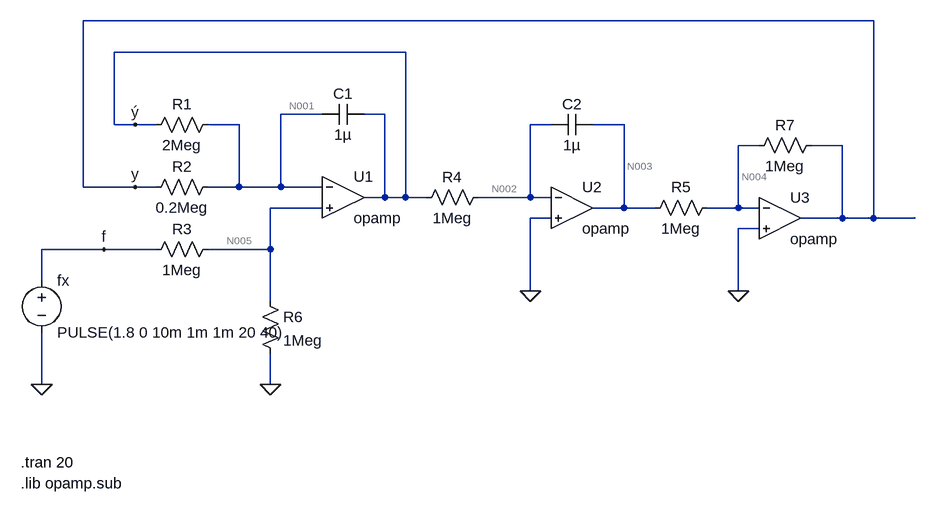
[diagram p0: schematic hw2.asc]
hw2.asc, the LTspice schematic file:
Version 4.1
SHEET 1 964 680
WIRE 896 -128 -320 -128
WIRE 176 -80 -272 -80
WIRE 48 16 -16 16
WIRE 144 16 112 16
WIRE -272 32 -272 -80
WIRE -240 32 -272 32
WIRE -208 32 -240 32
WIRE -80 32 -128 32
WIRE 400 32 368 32
WIRE 512 32 464 32
WIRE 720 64 688 64
WIRE 848 64 800 64
WIRE -320 128 -320 -128
WIRE -240 128 -320 128
WIRE -208 128 -240 128
WIRE -80 128 -80 32
WIRE -80 128 -128 128
WIRE -16 128 -16 16
WIRE -16 128 -80 128
WIRE 48 128 -16 128
WIRE 144 144 144 16
WIRE 144 144 112 144
WIRE 176 144 176 -80
WIRE 176 144 144 144
WIRE 208 144 176 144
WIRE 368 144 368 32
WIRE 368 144 288 144
WIRE 400 144 368 144
WIRE 48 160 -32 160
WIRE 512 160 512 32
WIRE 512 160 464 160
WIRE 560 160 512 160
WIRE 688 160 688 64
WIRE 688 160 640 160
WIRE 720 160 688 160
WIRE 400 176 368 176
WIRE 848 176 848 64
WIRE 848 176 784 176
WIRE 896 176 896 -128
WIRE 896 176 848 176
WIRE 960 176 896 176
WIRE 720 192 688 192
WIRE -288 224 -384 224
WIRE -208 224 -288 224
WIRE -32 224 -32 160
WIRE -32 224 -128 224
WIRE -384 272 -384 224
WIRE 368 288 368 176
WIRE 688 288 688 192
WIRE -32 304 -32 224
WIRE -384 432 -384 352
WIRE -32 432 -32 384
FLAG -32 432 0
FLAG 688 288 0
FLAG 368 288 0
FLAG -240 128 y
FLAG -240 32 ý
FLAG -288 224 f
FLAG -384 432 0
SYMBOL cap 112 0 R90
WINDOW 0 0 32 VBottom 2
WINDOW 3 32 32 VTop 2
SYMATTR InstName C1
SYMATTR Value 1µ
SYMBOL cap 464 16 R90
WINDOW 0 0 32 VBottom 2
WINDOW 3 32 32 VTop 2
SYMATTR InstName C2
SYMATTR Value 1µ
SYMBOL OpAmps\\opamp 80 80 R0
SYMATTR InstName U1
SYMBOL OpAmps\\opamp 432 96 R0
SYMATTR InstName U2
SYMBOL OpAmps\\opamp 752 112 R0
SYMATTR InstName U3
SYMBOL res -112 16 R90
WINDOW 0 0 56 VBottom 2
WINDOW 3 32 56 VTop 2
SYMATTR InstName R1
SYMATTR Value 2Meg
SYMBOL res -112 112 R90
WINDOW 0 0 56 VBottom 2
WINDOW 3 32 56 VTop 2
SYMATTR InstName R2
SYMATTR Value 0.2Meg
SYMBOL res -112 208 R90
WINDOW 0 0 56 VBottom 2
WINDOW 3 32 56 VTop 2
SYMATTR InstName R3
SYMATTR Value 1Meg
SYMBOL res 304 128 R90
WINDOW 0 0 56 VBottom 2
WINDOW 3 32 56 VTop 2
SYMATTR InstName R4
SYMATTR Value 1Meg
SYMBOL res 656 144 R90
WINDOW 0 0 56 VBottom 2
WINDOW 3 32 56 VTop 2
SYMATTR InstName R5
SYMATTR Value 1Meg
SYMBOL res -48 288 R0
SYMATTR InstName R6
SYMATTR Value 1Meg
SYMBOL res 816 48 R90
WINDOW 0 0 56 VBottom 2
WINDOW 3 32 56 VTop 2
SYMATTR InstName R7
SYMATTR Value 1Meg
SYMBOL voltage -384 256 R0
WINDOW 123 0 0 Left 0
WINDOW 39 0 0 Left 0
SYMATTR InstName fx
SYMATTR Value PULSE(1.8 0 10m 1m 1m 20 40)
TEXT -416 552 Left 2 !.tran 20
TEXT -416 584 Left 2 !.lib opamp.sub

The netlist it stands for:
* hw2.asc
C1 ý N001 1µ
C2 N003 N002 1µ
X§U1 N001 N005 ý opamp Aol=100K GBW=10Meg  ; pins invin noninvin out
X§U2 N002 0 N003 opamp Aol=100K GBW=10Meg  ; pins invin noninvin out
X§U3 N004 0 y opamp Aol=100K GBW=10Meg  ; pins invin noninvin out
R1 N001 ý 2Meg
R2 N001 y 0.2Meg
R3 N005 f 1Meg
R4 N002 ý 1Meg
R5 N004 N003 1Meg
R6 N005 0 1Meg
R7 y N004 1Meg
V§fx f 0 PULSE(1.8 0 10m 1m 1m 20 40)
.tran 20
.lib opamp.sub
.backanno
.end

* Results of the author's LTspice run, read from the files saved beside the schematic
* Operating Point, zero values left out:
*   V(f) = 1.8 V
*   V(n001) = 900 mV
*   V(n002) = 9.9 µV
*   V(n003) = -990 mV
*   V(n004) = -9.9 µV
*   V(n005) = 900 mV
*   V(y) = 990 mV
*   V(ý) = 9.9 µV
*   I(R1) = 450 nA
*   I(R2) = -450 nA
*   I(R3) = -900 nA
*   I(R5) = 990 nA
*   I(R6) = 900 nA
*   I(R7) = 990 nA
*   I(fx) = -900 nA
*   Ix(u1:3) = 450 nA
*   Ix(u2:3) = 990 nA
*   Ix(u3:3) = -1.44 µA
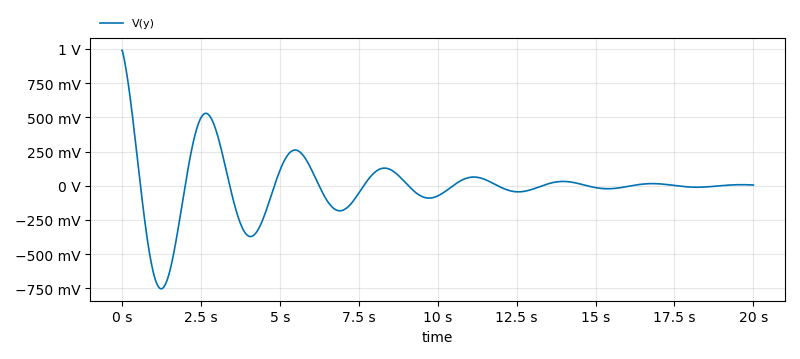
[diagram p1: Transient Analysis of hw2.asc, plotted from the saved traces]
* Transient Analysis, 1 run:
*   V(y): min -753.8 mV, max 990 mV, average -3.441 mV, rms 226.2 mV, last 5.272 mV